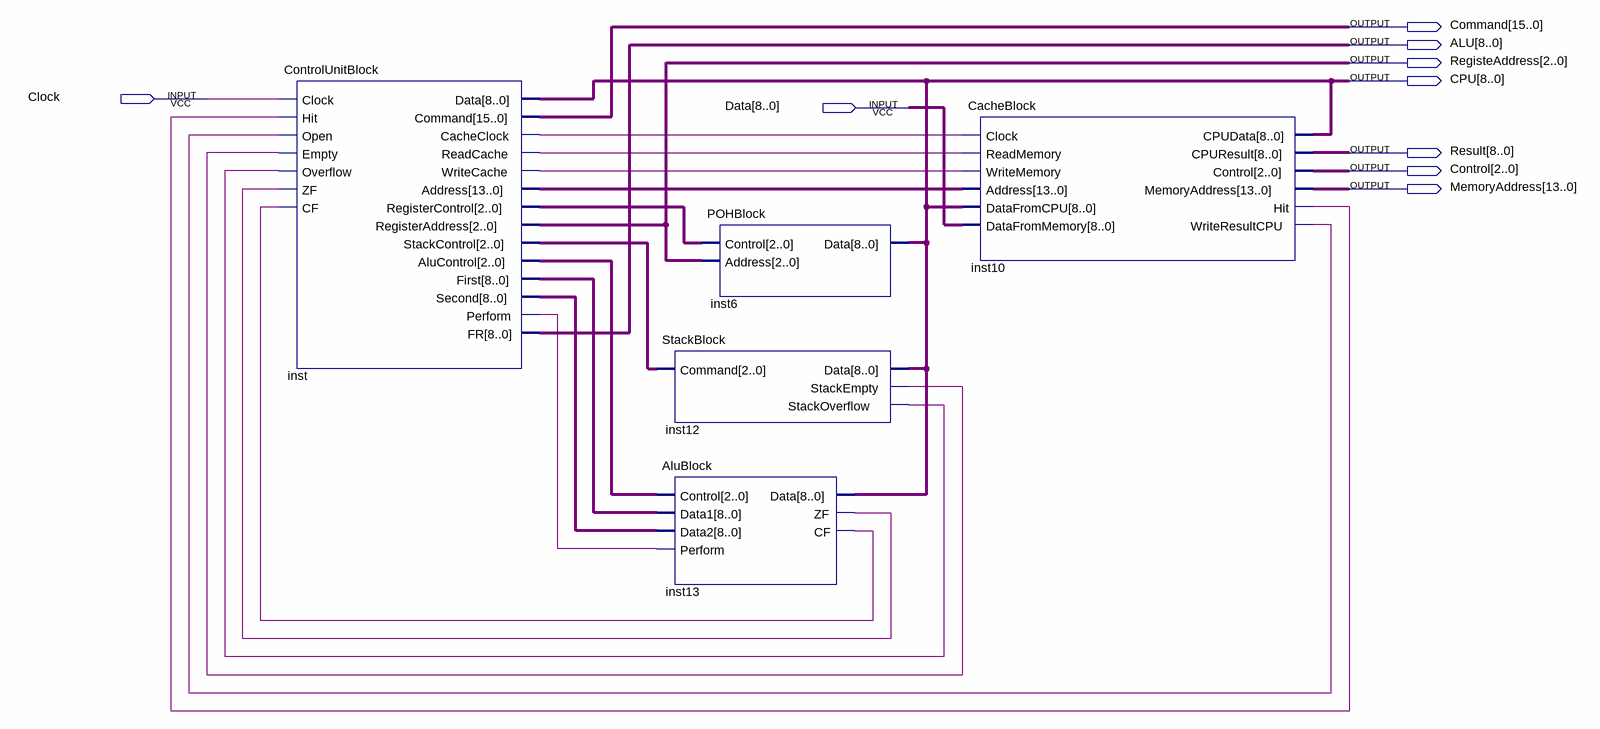
[diagram p0: schematic sheet]
// Quartus schematic CPU.bdf as structural Verilog: 5 symbols, 9 pins
module CPU (
  input  Clock,
  input  [8:0] Data,
  output [15:0] Command,
  output [8:0] ALU,
  output [2:0] RegisteAddress,
  output [8:0] CPU,
  output [8:0] Result,
  output [2:0] Control,
  output [13:0] MemoryAddress
);

  wire inst10_hit, inst10_writeresultcpu, inst12_stackempty, inst12_stackoverflow, inst13_cf, inst13_zf,
       inst_cacheclock, inst_perform, inst_readcache, inst_writecache;
  wire [2:0] inst_alucontrol, inst_registercontrol, inst_stackcontrol;
  wire [8:0] inst_first, inst_second;
  wire [13:0] inst_address;

  ControlUnitBlock inst (
    .Clock(Clock), .Hit(inst10_hit), .Open(inst10_writeresultcpu), .Empty(inst12_stackempty),
    .Overflow(inst12_stackoverflow), .ZF(inst13_zf), .CF(inst13_cf), .Command(Command),
    .CacheClock(inst_cacheclock), .ReadCache(inst_readcache), .WriteCache(inst_writecache),
    .Address(inst_address), .RegisterControl(inst_registercontrol), .RegisterAddress(RegisteAddress),
    .StackControl(inst_stackcontrol), .AluControl(inst_alucontrol), .First(inst_first), .Second(inst_second),
    .Perform(inst_perform), .FR(ALU), .Data(CPU));
  StackBlock inst12 (
    .Command(inst_stackcontrol), .StackEmpty(inst12_stackempty), .StackOverflow(inst12_stackoverflow),
    .Data(CPU));
  AluBlock inst13 (
    .Control(inst_alucontrol), .Data1(inst_first), .Data2(inst_second), .Perform(inst_perform), .Data(CPU),
    .ZF(inst13_zf), .CF(inst13_cf));
  POHBlock inst6 (.Control(inst_registercontrol), .Address(RegisteAddress), .Data(CPU));
  CacheBlock inst10 (
    .Clock(inst_cacheclock), .ReadMemory(inst_readcache), .WriteMemory(inst_writecache),
    .Address(inst_address), .DataFromCPU(CPU), .DataFromMemory(Data), .CPUData(CPU), .CPUResult(Result),
    .Control(Control), .MemoryAddress(MemoryAddress), .Hit(inst10_hit), .WriteResultCPU(inst10_writeresultcpu));
endmodule
